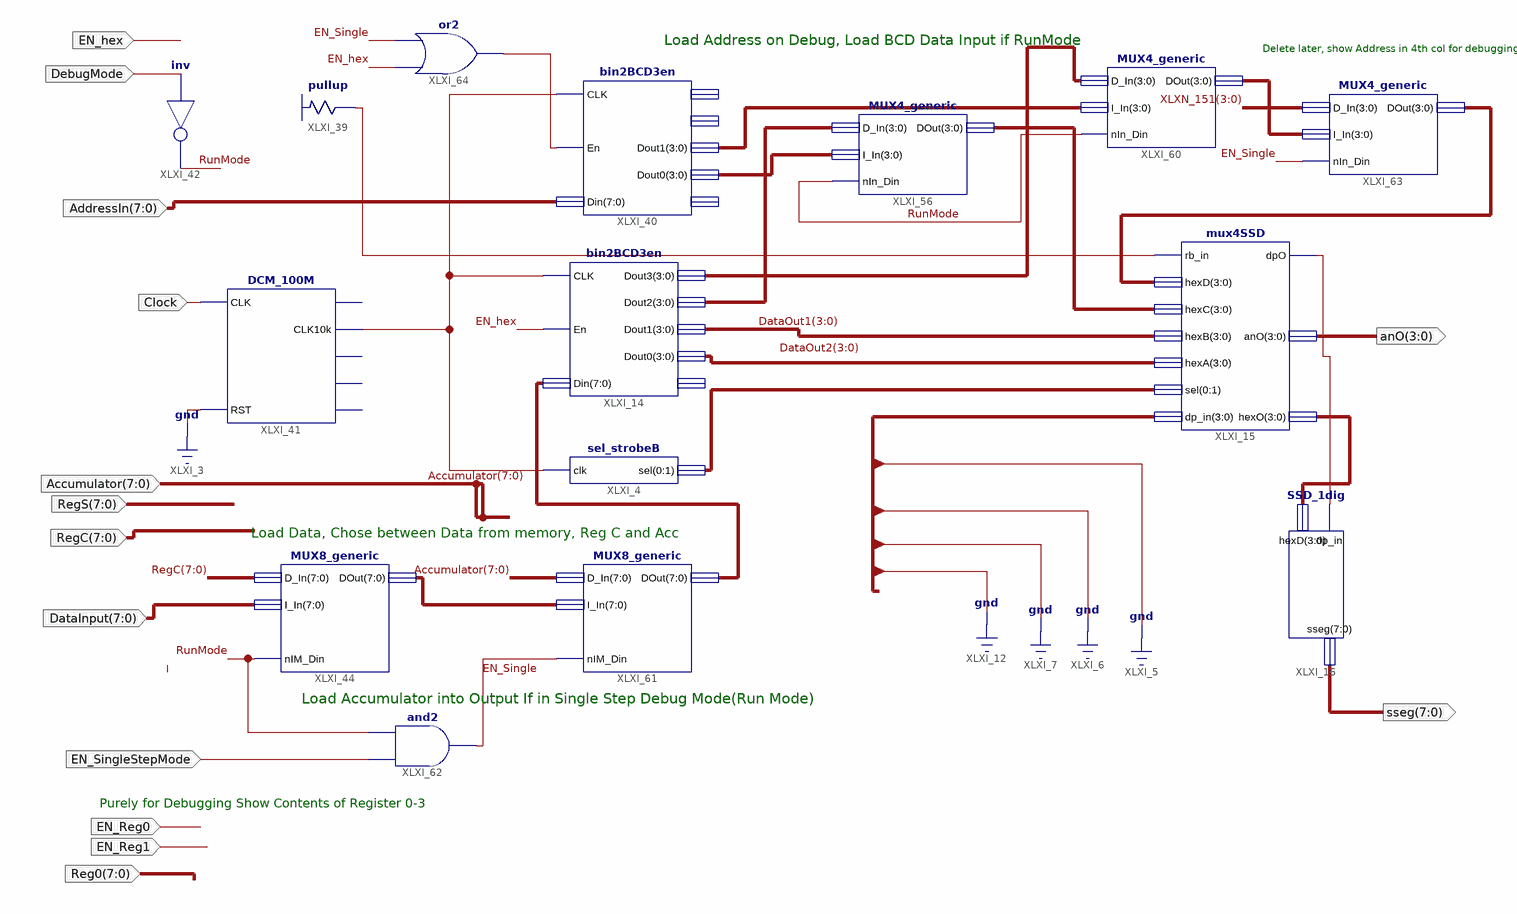
[diagram p0: schematic sheet 1]
// Xilinx ISE schematic Output_DebugMode.sch (spartan3e) as structural Verilog: 15 symbols, 14 ports
module Output_DebugMode (
  input  Clock,
  input  EN_hex,
  input  DebugMode,
  input  [7:0] AddressIn,
  input  [7:0] DataInput,
  input  [7:0] RegS,
  input  EN_SingleStepMode,
  input  [7:0] RegC,
  input  [7:0] Accumulator,
  input  EN_Reg0,
  input  EN_Reg1,
  input  [7:0] Reg0,
  output [7:0] sseg,
  output [3:0] anO
);

  wire EN_Single, RunMode, XLXN_69, XLXN_84, XLXN_86, XLXN_180;
  wire [1:0] XLXN_15;
  wire [3:0] DataOut1, DataOut2, XLXN_13, XLXN_151, XLXN_152, XLXN_153, XLXN_156, XLXN_157, XLXN_173,
       XLXN_174;
  wire [7:0] XLXN_160, XLXN_161;

  sel_strobeB XLXI_4 (.clk(XLXN_69), .sel({XLXN_15[0], XLXN_15[1]}));
  bin2BCD3en XLXI_14 (
    .CLK(XLXN_69), .En(EN_hex), .Din(XLXN_160), .Dout3(XLXN_156), .Dout2(XLXN_157), .Dout1(DataOut1),
    .Dout0(DataOut2));  // open: RBout
  bin2BCD3en XLXI_40 (
    .CLK(XLXN_69), .En(XLXN_180), .Din(AddressIn), .Dout1(XLXN_152), .Dout0(XLXN_151));  // open: Dout3, Dout2, RBout
  DCM_100M XLXI_41 (.CLK(Clock), .RST(1'b0), .CLK10k(XLXN_69));  // open: CLK1M, CLK1k, CLK100, CLK1
  not XLXI_42 (RunMode, DebugMode);
  \pullup  XLXI_39 (.O(XLXN_86));
  MUX8_generic XLXI_44 (.D_In(RegC), .I_In(DataInput), .DOut(XLXN_161), .nIM_Din(RunMode));
  SSD_1dig XLXI_16 (.dp_in(XLXN_84), .hexD(XLXN_13), .sseg(sseg));
  mux4SSD XLXI_15 (
    .rb_in(XLXN_86), .hexD(XLXN_174), .hexC(XLXN_153), .hexB(DataOut1), .hexA(DataOut2),
    .sel({XLXN_15[0], XLXN_15[1]}), .dp_in(4'b0000), .dpO(XLXN_84), .anO(anO), .hexO(XLXN_13));
  MUX4_generic XLXI_56 (.D_In(XLXN_157), .I_In(XLXN_151), .nIn_Din(RunMode), .DOut(XLXN_153));
  MUX4_generic XLXI_60 (.D_In(XLXN_156), .I_In(XLXN_152), .nIn_Din(RunMode), .DOut(XLXN_173));
  MUX8_generic XLXI_61 (.D_In(Accumulator), .I_In(XLXN_161), .DOut(XLXN_160), .nIM_Din(EN_Single));
  and XLXI_62 (EN_Single, EN_SingleStepMode, RunMode);
  MUX4_generic XLXI_63 (.D_In(XLXN_151), .I_In(XLXN_173), .nIn_Din(EN_Single), .DOut(XLXN_174));
  or XLXI_64 (XLXN_180, EN_hex, EN_Single);

  // Notes on the sheet:
  //   Load Address on Debug, Load BCD Data Input if RunMode
  //   Delete later, show Address in 4th col for debugging
  //   Load Data, Chose between Data from memory, Reg C and Acc
  //   Load Accumulator into Output If in Single Step Debug Mode(Run Mode)
  //   Purely for Debugging Show Contents of Register 0-3
endmodule
